# Altium schematic sheet MCU_USB.SchDoc
size A
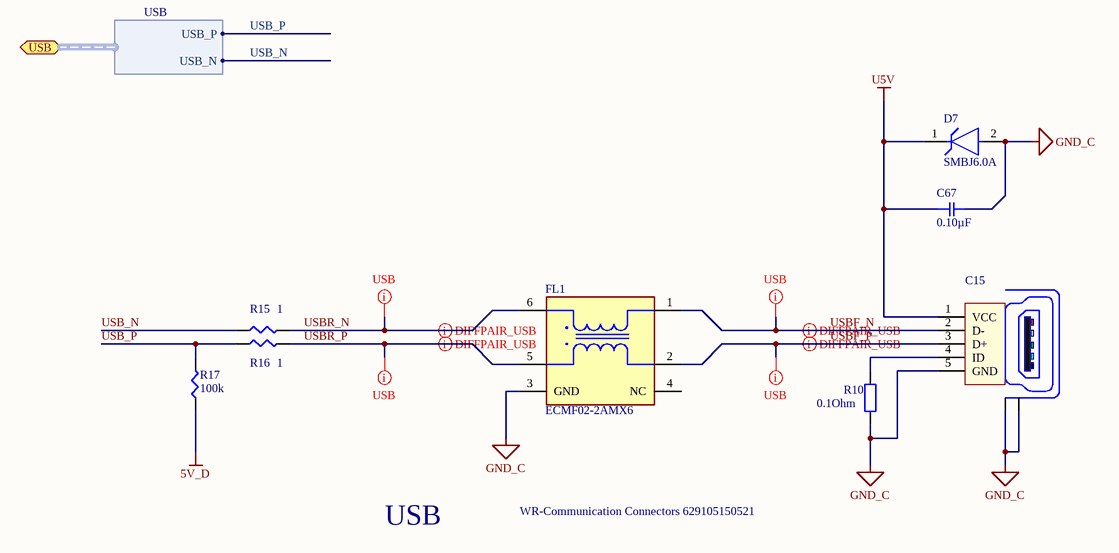
[diagram p0: MCU_USB.SchDoc]

## Parts
C15  WR-Communication Connectors 629105150521  [629105150521]
C67  0.10µF  [SMD-0805C]
D7  SMBJ6.0A  [FP-SMBJ-MFG]
FL1  ECMF02-2AMX6  [FP-QFN-6L-MFG]
R10  0.1Ohm  [WRIS-KSKE_0603_H=0.45mm]
R15  1  [SMD-0603-RES]
R16  1  [SMD-0603-RES]
R17  100k  [SMD-0603-RES]

## Ports
USB (bidir, harness USB)

## Harnesses
USB: USB_P, USB_N

## Nets
5V_D: R17.1
GND_C: C15.5(GND) C15.Z1(Shield) C15.Z2(Shield) C67.2 D7.2(A) FL1.3(GND) R10.2
U5V: C15.1(VCC) C67.1 D7.1(C)
USB_N: R15.1 ; port USB.USB_N
USB_P: R16.1 R17.2 ; port USB.USB_P
USBF_N: C15.2(D-) FL1.1(D+)
USBF_P: C15.3(D+) FL1.2(D-)
USBR_N: FL1.6(D+) R15.2
USBR_P: FL1.5(D-) R16.2
NetC15_4: C15.4(ID) R10.1

Not connected (* = marked no-connect by the designer): FL1 4(NC)

## Layout directives
rule Undefined; rule Matched Net Lengths [Tolerance = 0.2mm]; rule Impedance Constraint [Min = 85.00    Max = 95.00    ]: USBF_N, USBF_P, USBR_N, USBR_P
differential pair; rule Impedance Constraint [Min = 85.00    Max = 95.00    ]: USBF_N, USBF_P, USBR_N, USBR_P

## Notes on the sheet
- USB

## Library data of the parts
C15 = WR-Communication Connectors 629105150521: WR-COM_USB_Micro Type B_Horizontal_SMT; Manufacturer: Würth Elektronik eiSos GmbH; ComponentLink1 Description: Manufacturer; ComponentLink2 Description: Datasheet; NoPins: 5; ComponentLink1URL: http://www.we-online.de; ComponentLink2URL: http://katalog.we-online.de/em/datasheet/629105150521.pdf; Created by: Karrer Zheng; Created Date: 10/21/2014; partNo: 629105150521
C67 = GCJ21BR72A104KA01L: CAP CER 0.1UF 100V X7R 0805; Manufacturer: Murata Electronics North America; Factory Stock: 0; Unit Price (USD): 0.32; Minimum Quantity: 1; Tolerance: ±10%; Datasheets: http://www.murata.com/~/media/webrenewal/support/library/catalog/products/capacitor/mlcc/c03e.ashx; Image: //media.digikey.com/Renders/Murata%20Renders/0805%20(2012%20Metric)%20.85mm.jpg; Digi-Key Part Number: 490-5825-1-ND; Part Number: GCJ21BR72A104KA01L; Quantity Available: 1873; @ qty: 0; Packaging: Cut Tape (CT); Series: GCJ; Part Status: Active; Value: 0.10µF; Voltage: 100V; Temperature Coefficient: X7R; Operating Temperature: -55°C ~ 125°C; Features: Soft Termination; Ratings: AEC-Q200; Applications: Automotive, Boardflex Sensitive; Mounting Type: Surface Mount, MLCC; Package / Case: 0805 (2012 Metric); Size / Dimension: 0.079" L x 0.049" W (2.00mm x 1.25mm); Height - Seated (Max): -; Thickness (Max): 0.049" (1.25mm); Lead Spacing: -; Lead Style: -
D7 = CMP-08607-000069-1: TVS DIODE 6V 10.3V DO214AA; Manufacturer: Littelfuse Inc; Breakdown Voltage: 6.67V; Direction: Unidirectional; Number Of Channels: 1; Peak Pulse Power: 600W; Peak Pulse Current: 58.3A; Max Junction Temp: +150°C; Category: Diode; ComponentLink2Description: Datasheet; Octopart: https://octopart.com/smbj6.0a-littelfuse-66100; Clamping Voltage: 10.3V; Device Class L3: unset; Temperature Range Low: -65°C; Temperature: -65°C to +150°C; ComponentLink2URL: https://www.littelfuse.com/~/media/electronics/datasheets/tvs_diodes/littelfuse_tvs_diode_smbj_datasheet.pdf.pdf; Height: 2.61mm; Digikey Description: TVS DIODE 6V 10.3V DO214AA; Manufacturer Part Number: SMBJ6.0A; Temperature Range High: +150°C; Device Class L2: TVS Diodes; Mouser Description: In a Pack of 10, Littelfuse SMBJ6.0A, Uni-Directional TVS Diode, 600W, 2-Pin DO-214AA; Automotive: No; RoHS: TRUE; Device Class L1: Circuit Protection; Reverse Standoff Voltage: 6V; Lead Free: Yes; Package: SMBJ
FL1 = CMP-12075-000001-1: CMC 200MA 2LN SMD ESD; Manufacturer: STMicroelectronics; Standoff Height: 0mm; Max Junction Temp: +125°C; Series Resistance: 2.5Ω; Device Class L2: EMI / RFI Components; Device Class L1: Passive Components; Height: 0.55mm; Lead Free: Yes; Package: QFN-6L; Temperature Range Low: -55°C; Octopart: https://octopart.com/ecmf02-2amx6-stmicroelectronics-44353078; Mouser Description: TVS Diodes / ESD Suppressors ESD Mode Filter 6GHz USB 2.0 MIPI 8kV; Device Class L3: Common Mode Chokes; ComponentLink2URL: https://www.st.com/resource/en/datasheet/ecmf02-2amx6.pdf; Ipc Land Pattern Name: DFN170X150X50-6; ComponentLink2Description: Datasheet; Automotive: No; Temperature Range High: +125°C; Temperature: -55°C to +125°C; RoHS: TRUE; Digikey Description: CMC 200MA 2LN SMD ESD; Manufacturer Part Number: ECMF02-2AMX6; Category: Filter
R10 = 560050316001: WRIS-KSKE Thick Film Resistors, size 0603, 0.1Ohm, +/-1%, 0.25W; Rated Current: 1.58A; Temperature Coefficient of Resistance: 250ppm/degC; Technical Reference: KE0603R100F104LAATP0000; ComponentLink1Description: Manufacturer; ComponentLink1URL: http://www.we-online.de; ComponentLink2Description: Datasheet; ComponentLink2URL: https://katalog.we-online.com/pbs/datasheet/560050316001.pdf; Publisher: Wurth Elektronik; Rated Power: 0.25W; Resistance: 0.1Ohm; Mounting Technology: SMT; Height: 0.45mm; Part Number: 560050316001; Packaging: Tape and Reel; Published Date: September 2019; Size: 0603; Length: 1.6mm; Operating Temperature: -55 to +155degC; Resistance Tolerance: +/-1%; Width: 0.8mm
R15 R16 = ERJ-3BQF1R0V: RES SMD 1 OHM 1% 1/4W 0603; Manufacturer: Panasonic Electronic Components; Factory Stock: 0; Unit Price (USD): 0.05386; @ qty: 1500; Power (Watts): 0.25W, 1/4W; Temperature Coefficient: ±200ppm/°C; Part Number: ERJ-3BQF1R0V; Datasheets: https://industrial.panasonic.com/cdbs/www-data/pdf/RDA0000/AOA0000C239.pdf; Image: //media.digikey.com/Photos/Panasonic%20Photos/MFG_ERJ-P6W%20Series.jpg; Digi-Key Part Number: P17371CT-ND; Quantity Available: 30514; Minimum Quantity: 1; Packaging: Cut Tape (CT); Series: ERJ; Part Status: Active; Value: 1; Tolerance: ±1%; Composition: Thick Film; Features: Automotive AEC-Q200, Current Sense; Operating Temperature: -55°C ~ 125°C; Package / Case: 0603 (1608 Metric); Supplier Device Package: 0603; Size / Dimension: 0.063" L x 0.031" W (1.60mm x 0.80mm); Height - Seated (Max): 0.022" (0.55mm); Number of Terminations: 2; Failure Rate: -
R17 = ERJ-3EKF1003V: RES SMD 100K OHM 1% 1/10W 0603; Manufacturer: Panasonic Electronic Components; Factory Stock: 0; Unit Price (USD): 0.00379; @ qty: 1500; Minimum Quantity: 1; Power (Watts): 0.1W, 1/10W; Temperature Coefficient: ±100ppm/°C; Part Number: ERJ-3EKF1003V; Datasheets: http://industrial.panasonic.com/www-cgi/jvcr13pz.cgi?E+PZ+3+AOA0002+ERJ3EKF1003V+7+WW; Image: //media.digikey.com/Photos/Panasonic%20Photos/MFG_ERJ-P6W%20Series.jpg; Digi-Key Part Number: P100KHCT-ND; Quantity Available: 2179804; Packaging: Cut Tape (CT); Series: ERJ; Part Status: Active; Value: 100k; Tolerance: ±1%; Composition: Thick Film; Features: Automotive AEC-Q200; Operating Temperature: -55°C ~ 155°C; Package / Case: 0603 (1608 Metric); Supplier Device Package: 0603; Size / Dimension: 0.063" L x 0.031" W (1.60mm x 0.80mm); Height - Seated (Max): 0.022" (0.55mm); Number of Terminations: 2; Failure Rate: -